# Altium schematic sheet 14 EC1 PHY.SchDoc
size 594 x 420 mm
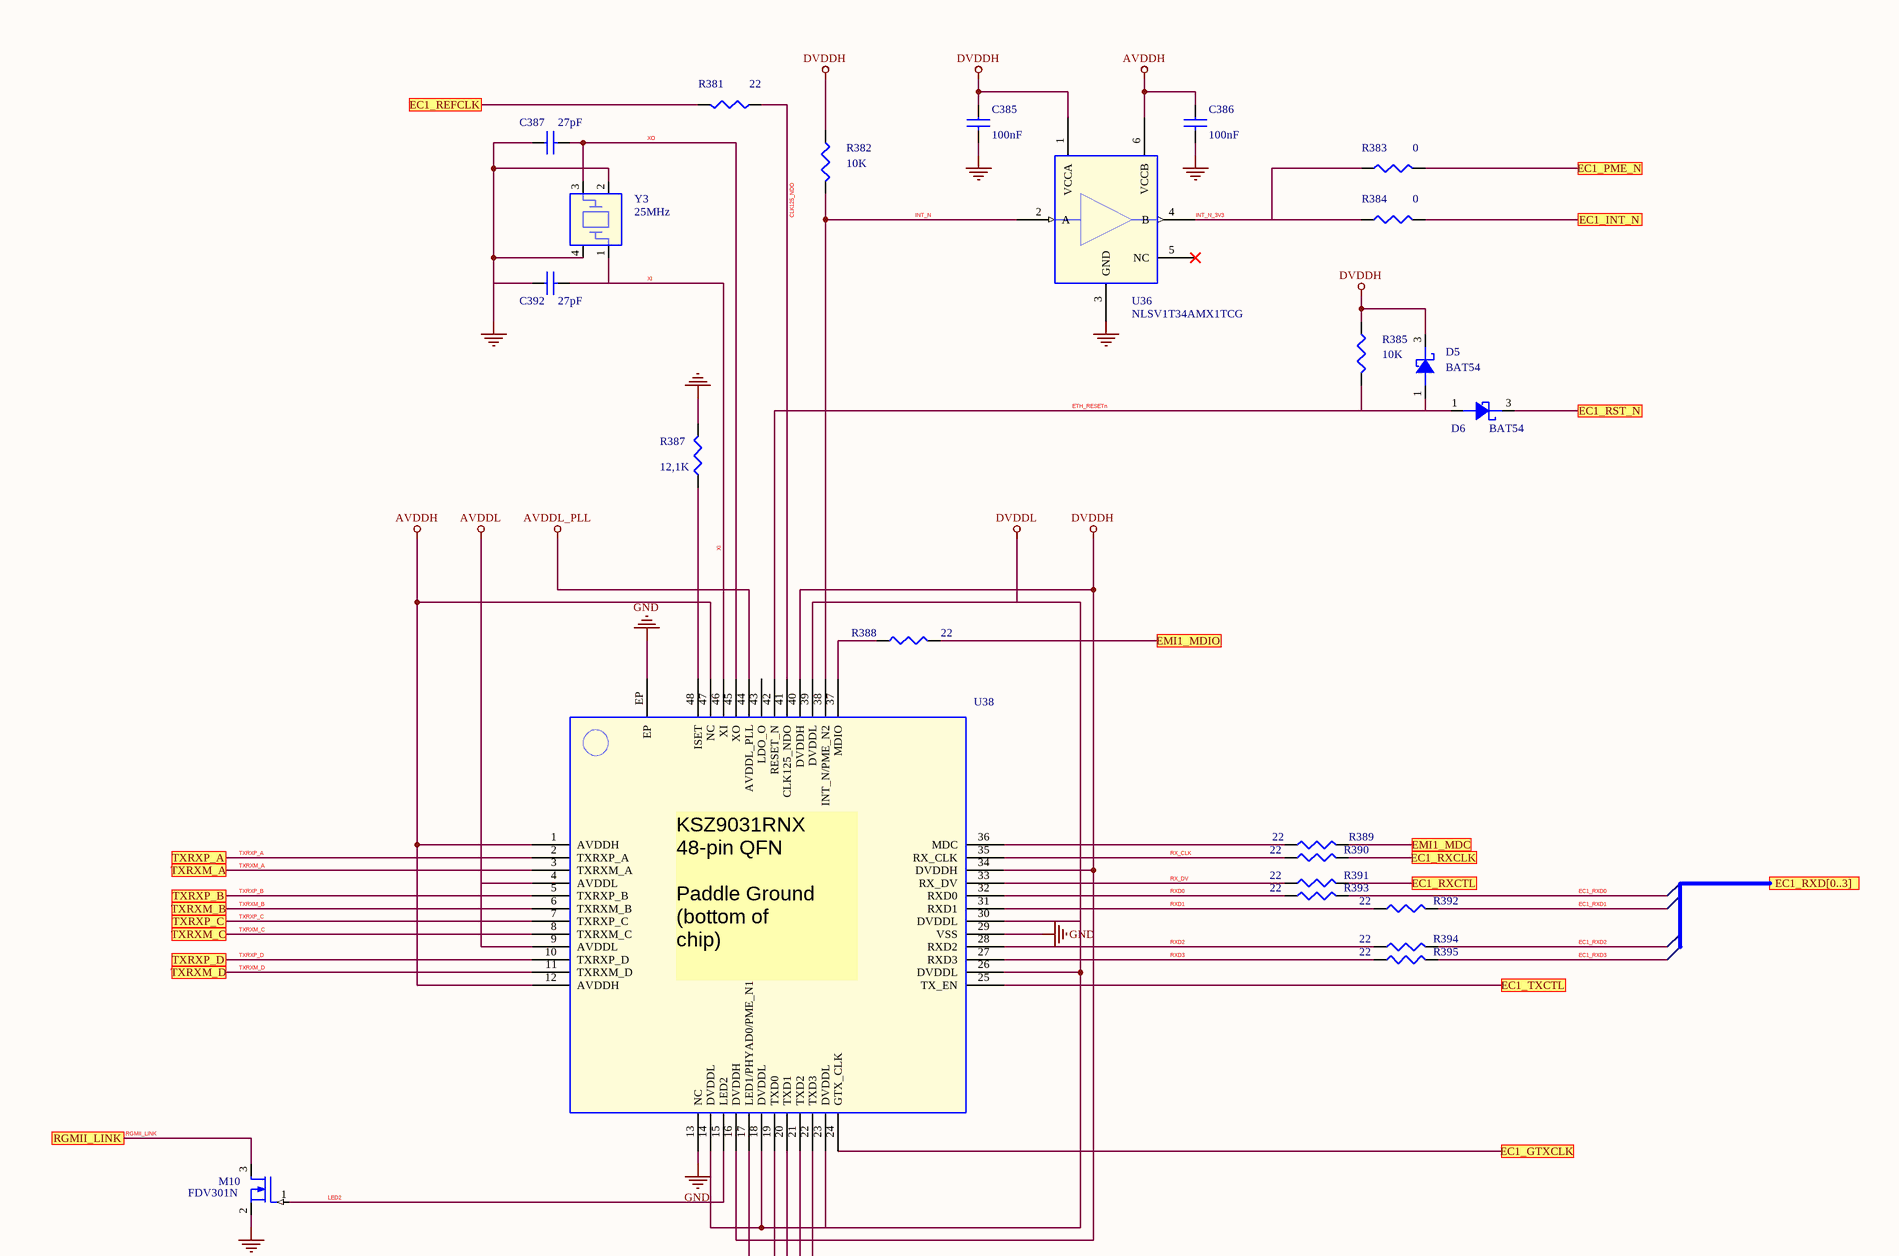
[diagram p0: 14 EC1 PHY.SchDoc, top left]
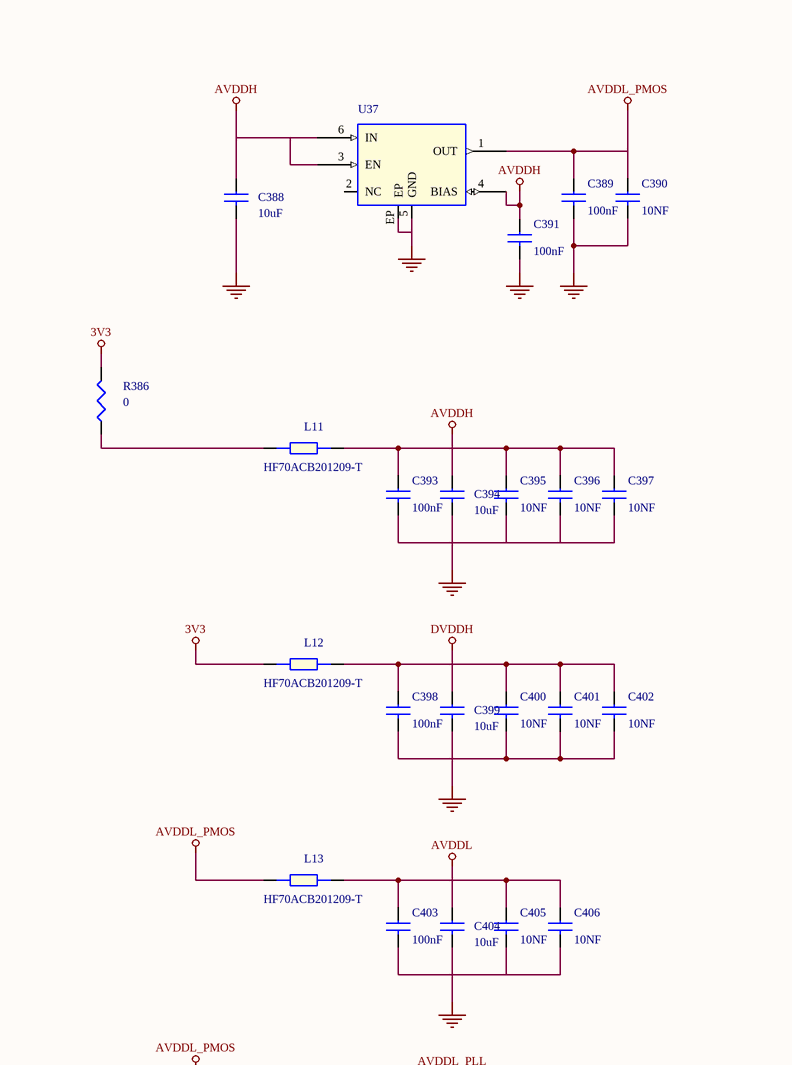
[diagram p1: 14 EC1 PHY.SchDoc, top right]
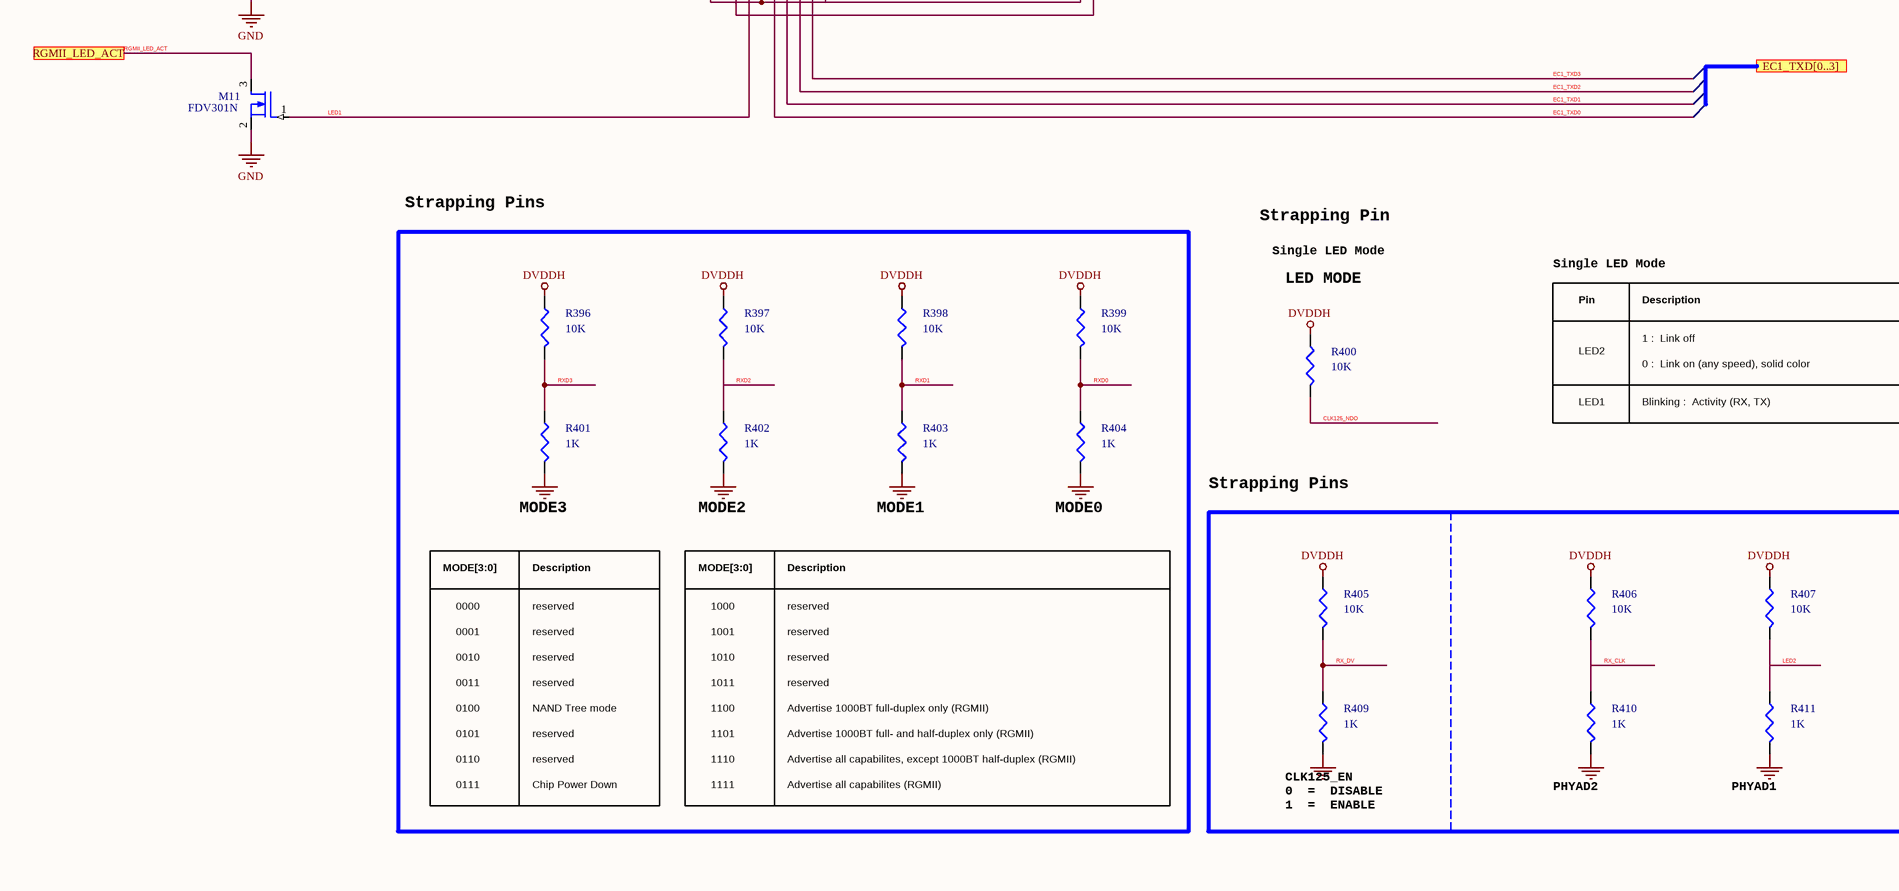
[diagram p2: 14 EC1 PHY.SchDoc, bottom left]
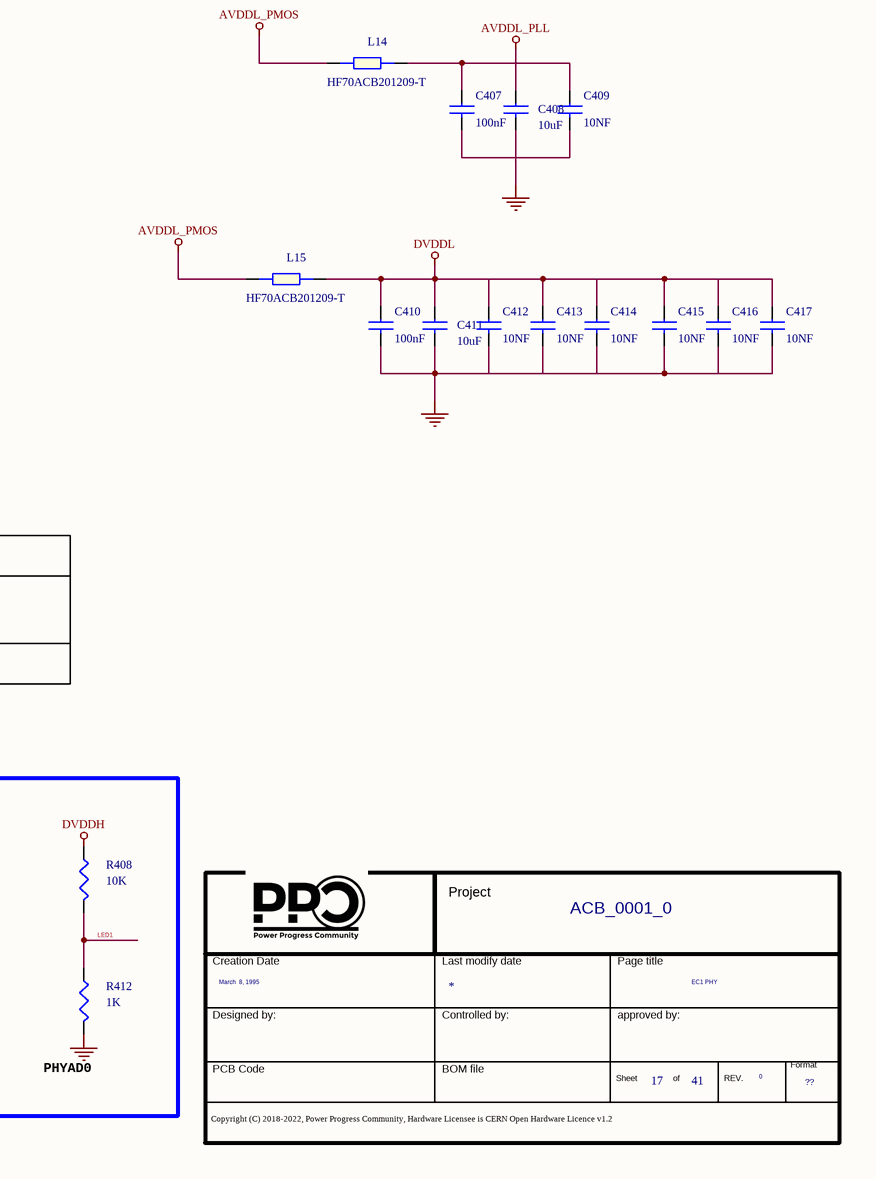
[diagram p3: 14 EC1 PHY.SchDoc, bottom right]

## Parts
*  Page Count: 41  Page Create Date: March  8, 1995  Page Number: 17  Page Size: ??  Page Title: EC1 PHY  RevCode: 0  Title: ACB_0001_0  (hidden comment: Title_block_PPC)  (graphical)
C385  100nF  [SMD_0402]
C386  100nF  [SMD_0402]
C387  27pF  [SMD_0402]
C388  10uF  [SMD_0603]
C389  100nF  [SMD_0402]
C390  10NF  [SMD_0402]
C391  100nF  [SMD_0402]
C392  27pF  [SMD_0402]
C393  100nF  [SMD_0402]
C394  10uF  [SMD_0603]
C395  10NF  [SMD_0402]
C396  10NF  [SMD_0402]
C397  10NF  [SMD_0402]
C398  100nF  [SMD_0402]
C399  10uF  [SMD_0603]
C400  10NF  [SMD_0402]
C401  10NF  [SMD_0402]
C402  10NF  [SMD_0402]
C403  100nF  [SMD_0402]
C404  10uF  [SMD_0603]
C405  10NF  [SMD_0402]
C406  10NF  [SMD_0402]
C407  100nF  [SMD_0402]
C408  10uF  [SMD_0603]
C409  10NF  [SMD_0402]
C410  100nF  [SMD_0402]
C411  10uF  [SMD_0603]
C412  10NF  [SMD_0402]
C413  10NF  [SMD_0402]
C414  10NF  [SMD_0402]
C415  10NF  [SMD_0402]
C416  10NF  [SMD_0402]
C417  10NF  [SMD_0402]
D5  BAT54  [SOT-23]
D6  BAT54  [SOT-23]
L11  HF70ACB201209-T  [SMD_0805]
L12  HF70ACB201209-T  [SMD_0805]
L13  HF70ACB201209-T  [SMD_0805]
L14  HF70ACB201209-T  [SMD_0805]
L15  HF70ACB201209-T  [SMD_0805]
M10  FDV301N  [sot23]
M11  FDV301N  [sot23]
R381  22  [SMD_0402]
R382  10K  [SMD_0402]
R383  0  [SMD_0402]
R384  0  [SMD_0402]
R385  10K  [SMD_0402]
R386  0  [SMD_0402]
R387  12,1K  [SMD_0402]
R388  22  [SMD_0402]
R389  22  [SMD_0402]
R390  22  [SMD_0402]
R391  22  [SMD_0402]
R392  22  [SMD_0402]
R393  22  [SMD_0402]
R394  22  [SMD_0402]
R395  22  [SMD_0402]
R396  10K  [SMD_0402]
R397  10K  [SMD_0402]
R398  10K  [SMD_0402]
R399  10K  [SMD_0402]
R400  10K  [SMD_0402]
R401  1K  [SMD_0402]
R402  1K  [SMD_0402]
R403  1K  [SMD_0402]
R404  1K  [SMD_0402]
R405  10K  [SMD_0402]
R406  10K  [SMD_0402]
R407  10K  [SMD_0402]
R408  10K  [SMD_0402]
R409  1K  [SMD_0402]
R410  1K  [SMD_0402]
R411  1K  [SMD_0402]
R412  1K  [SMD_0402]
U36  NLSV1T34AMX1TCG  [6-XFLGA]
U37  TPS72012DRVT  [6SON]  (value not drawn)
U38  KSZ9031RNXCA  [QFN48]  (value not drawn)
Y3  25MHz  [SMD_5.0x3.2]

## Ports
EC1_GTXCLK, EC1_INT_N, EC1_PME_N, EC1_REFCLK, EC1_RST_N, EC1_RXCLK, EC1_RXCTL, EC1_RXD[0..3], EC1_TXCTL, EC1_TXD[0..3], EMI1_MDC, EMI1_MDIO, RGMII_LED_ACT, RGMII_LINK, TXRXM_A, TXRXM_B, TXRXM_C, TXRXM_D, TXRXP_A, TXRXP_B, TXRXP_C, TXRXP_D

## Nets
3V3: L12.1 R386.1
AVDDH: C386.1 C388.1 C391.1 C393.1 C394.1 C395.1 C396.1 C397.1 L11.2 U36.6(VCCB) U37.3(EN) U37.4(BIAS) U37.6(IN) U38.1(AVDDH) U38.12(AVDDH) U38.47(NC)
AVDDL: C403.1 C404.1 C405.1 C406.1 L13.2 U38.4(AVDDL) U38.9(AVDDL)
AVDDL_PLL: C407.1 C408.1 C409.1 L14.2 U38.44(AVDDL_PLL)
AVDDL_PMOS: C389.1 C390.1 L13.1 L14.1 L15.1 U37.1(OUT)
DVDDH: C385.1 C398.1 C399.1 C400.1 C401.1 C402.1 D5.3(CATHODE) L12.2 R382.1 R385.1 R396.1 R397.1 R398.1 R399.1 R400.1 R405.1 R406.1 R407.1 R408.1 U36.1(VCCA) U38.16(DVDDH) U38.34(DVDDH) U38.40(DVDDH)
DVDDL: C410.1 C411.1 C412.1 C413.1 C414.1 C415.1 C416.1 C417.1 L15.2 U38.14(DVDDL) U38.18(DVDDL) U38.23(DVDDL) U38.26(DVDDL) U38.30(DVDDL) U38.39(DVDDL)
GND: C385.2 C386.2 C387.1 C388.2 C389.2 C390.2 C391.2 C392.1 C393.2 C394.2 C395.2 C396.2 C397.2 C398.2 C399.2 C400.2 C401.2 C402.2 C403.2 C404.2 C405.2 C406.2 C407.2 C408.2 C409.2 C410.2 C411.2 C412.2 C413.2 C414.2 C415.2 C416.2 C417.2 M10.2(SOURCE) M11.2(SOURCE) R387.1 R401.2 R402.2 R403.2 R404.2 R409.2 R410.2 R411.2 R412.2 U36.3(GND) U37.5(GND) U37.EP U38.13(NC) U38.29(VSS) U38.EP Y3.2 Y3.4
CLK125_NDO: R381.1 R400.2 U38.41(CLK125_NDO)
EC1_GTXCLK: U38.24(GTX_CLK) ; port EC1_GTXCLK
EC1_INT_N: R384.1 ; port EC1_INT_N
EC1_PME_N: R383.1 ; port EC1_PME_N
EC1_REFCLK: R381.2 ; port EC1_REFCLK
EC1_RST_N: D6.3(CATHODE) ; port EC1_RST_N
EC1_RXCLK: R390.1 ; port EC1_RXCLK
EC1_RXCTL: R391.1 ; port EC1_RXCTL
EC1_RXD0: R393.1
EC1_RXD1: R392.1
EC1_RXD2: R394.1
EC1_RXD3: R395.1
EC1_TXCTL: U38.25(TX_EN) ; port EC1_TXCTL
EC1_TXD0: U38.19(TXD0)
EC1_TXD1: U38.20(TXD1)
EC1_TXD2: U38.21(TXD2)
EC1_TXD3: U38.22(TXD3)
EMI1_MDC: R389.1 ; port EMI1_MDC
EMI1_MDIO: R388.1 ; port EMI1_MDIO
ETH_RESETn: D5.1(ANODE) D6.1(ANODE) R385.2 U38.42(RESET_N)
INT_N: R382.2 U36.2(A) U38.38(INT_N/PME_N2)
INT_N_3V3: R383.2 R384.2 U36.4(B)
LED1: M11.1(GATE) R408.2 R412.1 U38.17(LED1/PHYAD0/PME_N1)
LED2: M10.1(GATE) R407.2 R411.1 U38.15(LED2)
RGMII_LED_ACT: M11.3(DRAIN) ; port RGMII_LED_ACT
RGMII_LINK: M10.3(DRAIN) ; port RGMII_LINK
RX_CLK: R390.2 R406.2 R410.1 U38.35(RX_CLK)
RX_DV: R391.2 R405.2 R409.1 U38.33(RX_DV)
RXD0: R393.2 R399.2 R404.1 U38.32(RXD0)
RXD1: R392.2 R398.2 R403.1 U38.31(RXD1)
RXD2: R394.2 R397.2 R402.1 U38.28(RXD2)
RXD3: R395.2 R396.2 R401.1 U38.27(RXD3)
TXRXM_A: U38.3(TXRXM_A) ; port TXRXM_A
TXRXM_B: U38.6(TXRXM_B) ; port TXRXM_B
TXRXM_C: U38.8(TXRXM_C) ; port TXRXM_C
TXRXM_D: U38.11(TXRXM_D) ; port TXRXM_D
TXRXP_A: U38.2(TXRXP_A) ; port TXRXP_A
TXRXP_B: U38.5(TXRXP_B) ; port TXRXP_B
TXRXP_C: U38.7(TXRXP_C) ; port TXRXP_C
TXRXP_D: U38.10(TXRXP_D) ; port TXRXP_D
XI: C392.2 U38.46(XI) Y3.1
XO: C387.2 U38.45(XO) Y3.3
NetL11_1: L11.1 R386.2
NetR387_2: R387.2 U38.48(ISET)
NetR388_2: R388.2 U38.37(MDIO)
NetR389_2: R389.2 U38.36(MDC)

Not connected (* = marked no-connect by the designer): U36 5(NC)*; U37 2(NC); U38 43(LDO_O)

## Notes on the sheet
- Strapping Pins
- Strapping Pin
- Single LED Mode
- LED MODE
- Pin
- Description
- LED2
- 1 :  Link off
- 0 :  Link on (any speed), solid color
- LED1
- Blinking :  Activity (RX, TX)
- (near R401) MODE3
- (near R402) MODE2
- (near R403) MODE1
- (near R404) MODE0
- MODE[3:0]
- 0000
- 0001
- reserved
- 1001
- 1000
- 0010
- 0011
- 1010
- 1011
- 0100
- 0101
- 0110
- NAND Tree mode
- 1101
- 1100
- 1110
- Advertise all capabilites, except 1000BT half-duplex (RGMII)
- Advertise 1000BT full-duplex only (RGMII)
- Advertise 1000BT full- and half-duplex only (RGMII)
- (near R409) CLK125_EN
  0  =  DISABLE
  1  =  ENABLE
- 0111
- Chip Power Down
- 1111
- Advertise all capabilites (RGMII)
- (near R410) PHYAD2
- (near R411) PHYAD1
- (near R412) PHYAD0
- (in symbol KSZ9031RNX_0) KSZ9031RNX / 48-pin QFN / Paddle Ground / (bottom of / chip)
- (in symbol Title_block_PPC) Project; Creation Date; Last modify date; Page title; Designed by:; Controlled by:; approved by:; Format; PCB Code; BOM file; Sheet; of; REV.; Copyright (C) 2018-2022, Power Progress Community, Hardware Licensee is CERN Open Hardware Licence v1.2

## Library data of the parts
C385 = CAP NP_Dup10: COND.CER. 100NF 50V 0402 X7R SMD; Part Number: PASSIVE_24; Manufacturer 1: TDK; Manufacturer Part Number 1: CGA2B3X7R1H104M050BD; RSM: RC0402; TECNO77: C0402; ID: C496; PCB Footprint: SMD_0402; Part Type: Capacitors\Ceramic\SMD\0402; Distributor 1: MURATA ELETTRONICA SPA
C386 = CAP NP_Dup10: COND.CER. 100NF 50V 0402 X7R SMD; Part Number: PASSIVE_24; Manufacturer 1: TDK; Manufacturer Part Number 1: CGA2B3X7R1H104M050BD; RSM: RC0402; TECNO77: C0402; ID: C497; PCB Footprint: SMD_0402; Part Type: Capacitors\Ceramic\SMD\0402; Distributor 1: MURATA ELETTRONICA SPA
C387 = CAP NP_Dup10: CAP CER 27PF 50V 5% NP0 0402; Part Number: PASSIVE_68; Manufacturer 1: TDK; Manufacturer Part Number 1: C1005C0G1H270J; RSM: RC0402; TECNO77: C0402; ID: C319; PCB Footprint: SMD_0402; Part Type: Capacitors\Ceramic\SMD\0402; Distributor 1: DIGIKEY (445-1240-1-ND)
C388 = CAP NP_Dup10: COND.CER.10uF 0603 25V SMD; Manufacturer Part Number 1: CL10A106MA8NRNC; Manufacturer 1: SAMSUNG; Part Number: PASSIVE_124; RSM: RC0603; TECNO77: C0402; ID: C325; PCB Footprint: SMD_0603; Distributor 1: DIGIKEY (1276-1450-2-ND); Part Type: Capacitors\Ceramic\SMD\0603
C389 = CAP NP_Dup10: COND.CER. 100NF 50V 0402 X7R SMD; Manufacturer Part Number 1: CGA2B3X7R1H104M050BD; Manufacturer 1: TDK; Part Number: PASSIVE_24; RSM: RC0402; TECNO77: C0402; ID: C322; PCB Footprint: SMD_0402; Distributor 1: MURATA ELETTRONICA SPA; Part Type: Capacitors\Ceramic\SMD\0402
C390 = CAP NP_Dup10: COND.CER. 10NF 50V 0402 X7R SMD; Part Number: PASSIVE_29; Manufacturer 1: KEMET; Manufacturer Part Number 1: C0402C103K5RACTU; RSM: RC0402; TECNO77: C0402; ID: C323; PCB Footprint: SMD_0402; Part Type: Capacitors\Ceramic\SMD\0402; Distributor 1: TTI ITALY SRL
C391 = CAP NP_Dup10: COND.CER. 100NF 50V 0402 X7R SMD; Part Number: PASSIVE_24; Manufacturer 1: TDK; Manufacturer Part Number 1: CGA2B3X7R1H104M050BD; RSM: RC0402; TECNO77: C0402; ID: C787; PCB Footprint: SMD_0402; Part Type: Capacitors\Ceramic\SMD\0402; Distributor 1: MURATA ELETTRONICA SPA
C392 = CAP NP_Dup10: CAP CER 27PF 50V 5% NP0 0402; Manufacturer Part Number 1: C1005C0G1H270J; Manufacturer 1: TDK; Part Number: PASSIVE_68; RSM: RC0402; TECNO77: C0402; ID: C320; PCB Footprint: SMD_0402; Distributor 1: DIGIKEY (445-1240-1-ND); Part Type: Capacitors\Ceramic\SMD\0402
C393 = CAP NP_Dup10: COND.CER. 100NF 50V 0402 X7R SMD; Part Number: PASSIVE_24; Manufacturer 1: TDK; Manufacturer Part Number 1: CGA2B3X7R1H104M050BD; RSM: RC0402; TECNO77: C0402; ID: C329; PCB Footprint: SMD_0402; Part Type: Capacitors\Ceramic\SMD\0402; Distributor 1: MURATA ELETTRONICA SPA
C394 = CAP NP_Dup3: COND.CER.10uF 0603 25V SMD; Manufacturer Part Number 1: CL10A106MA8NRNC; Manufacturer 1: SAMSUNG; Part Number: PASSIVE_124; RSM: RC0603; PCB Footprint: SMD_0603; Part Type: Capacitors\Ceramic\SMD\0603
C395 = CAP NP_Dup10: COND.CER. 10NF 50V 0402 X7R SMD; Part Number: PASSIVE_29; Manufacturer 1: KEMET; Manufacturer Part Number 1: C0402C103K5RACTU; RSM: RC0402; TECNO77: C0402; ID: C331; PCB Footprint: SMD_0402; Part Type: Capacitors\Ceramic\SMD\0402; Distributor 1: TTI ITALY SRL
C396 = CAP NP_Dup10: COND.CER. 10NF 50V 0402 X7R SMD; Part Number: PASSIVE_29; Manufacturer 1: KEMET; Manufacturer Part Number 1: C0402C103K5RACTU; RSM: RC0402; TECNO77: C0402; ID: C332; PCB Footprint: SMD_0402; Part Type: Capacitors\Ceramic\SMD\0402; Distributor 1: TTI ITALY SRL
C397 = CAP NP_Dup10: COND.CER. 10NF 50V 0402 X7R SMD; Part Number: PASSIVE_29; Manufacturer 1: KEMET; Manufacturer Part Number 1: C0402C103K5RACTU; RSM: RC0402; TECNO77: C0402; ID: C333; PCB Footprint: SMD_0402; Part Type: Capacitors\Ceramic\SMD\0402; Distributor 1: TTI ITALY SRL
C398 = CAP NP_Dup10: COND.CER. 100NF 50V 0402 X7R SMD; Manufacturer Part Number 1: CGA2B3X7R1H104M050BD; Manufacturer 1: TDK; Part Number: PASSIVE_24; RSM: RC0402; TECNO77: C0402; ID: C335; PCB Footprint: SMD_0402; Distributor 1: MURATA ELETTRONICA SPA; Part Type: Capacitors\Ceramic\SMD\0402
C399 = CAP NP_Dup10: COND.CER.10uF 0603 25V SMD; Part Number: PASSIVE_124; Manufacturer 1: SAMSUNG; Manufacturer Part Number 1: CL10A106MA8NRNC; RSM: RC0603; TECNO77: C0402; ID: C336; PCB Footprint: SMD_0603; Part Type: Capacitors\Ceramic\SMD\0603; Distributor 1: DIGIKEY (1276-1450-2-ND)
C400 = CAP NP_Dup10: COND.CER. 10NF 50V 0402 X7R SMD; Manufacturer Part Number 1: C0402C103K5RACTU; Manufacturer 1: KEMET; Part Number: PASSIVE_29; RSM: RC0402; TECNO77: C0402; ID: C337; PCB Footprint: SMD_0402; Distributor 1: TTI ITALY SRL; Part Type: Capacitors\Ceramic\SMD\0402
C401 = CAP NP_Dup10: COND.CER. 10NF 50V 0402 X7R SMD; Part Number: PASSIVE_29; Manufacturer 1: KEMET; Manufacturer Part Number 1: C0402C103K5RACTU; RSM: RC0402; TECNO77: C0402; ID: C338; PCB Footprint: SMD_0402; Part Type: Capacitors\Ceramic\SMD\0402; Distributor 1: TTI ITALY SRL
C402 = CAP NP_Dup10: COND.CER. 10NF 50V 0402 X7R SMD; Part Number: PASSIVE_29; Manufacturer 1: KEMET; Manufacturer Part Number 1: C0402C103K5RACTU; RSM: RC0402; TECNO77: C0402; ID: C339; PCB Footprint: SMD_0402; Part Type: Capacitors\Ceramic\SMD\0402; Distributor 1: TTI ITALY SRL
C403 = CAP NP_Dup10: COND.CER. 100NF 50V 0402 X7R SMD; Manufacturer Part Number 1: CGA2B3X7R1H104M050BD; Manufacturer 1: TDK; Part Number: PASSIVE_24; RSM: RC0402; TECNO77: C0402; ID: C340; PCB Footprint: SMD_0402; Distributor 1: MURATA ELETTRONICA SPA; Part Type: Capacitors\Ceramic\SMD\0402
C404 = CAP NP_Dup10: COND.CER.10uF 0603 25V SMD; Part Number: PASSIVE_124; Manufacturer 1: SAMSUNG; Manufacturer Part Number 1: CL10A106MA8NRNC; RSM: RC0603; TECNO77: C0402; ID: C341; PCB Footprint: SMD_0603; Part Type: Capacitors\Ceramic\SMD\0603; Distributor 1: DIGIKEY (1276-1450-2-ND)
C405 = CAP NP_Dup10: COND.CER. 10NF 50V 0402 X7R SMD; Part Number: PASSIVE_29; Manufacturer 1: KEMET; Manufacturer Part Number 1: C0402C103K5RACTU; RSM: RC0402; TECNO77: C0402; ID: C342; PCB Footprint: SMD_0402; Part Type: Capacitors\Ceramic\SMD\0402; Distributor 1: TTI ITALY SRL
C406 = CAP NP_Dup10: COND.CER. 10NF 50V 0402 X7R SMD; Manufacturer Part Number 1: C0402C103K5RACTU; Manufacturer 1: KEMET; Part Number: PASSIVE_29; RSM: RC0402; TECNO77: C0402; ID: C343; PCB Footprint: SMD_0402; Distributor 1: TTI ITALY SRL; Part Type: Capacitors\Ceramic\SMD\0402
C407 = CAP NP_Dup10: COND.CER. 100NF 50V 0402 X7R SMD; Manufacturer Part Number 1: CGA2B3X7R1H104M050BD; Manufacturer 1: TDK; Part Number: PASSIVE_24; RSM: RC0402; TECNO77: C0402; ID: C344; PCB Footprint: SMD_0402; Distributor 1: MURATA ELETTRONICA SPA; Part Type: Capacitors\Ceramic\SMD\0402
C408 = CAP NP_Dup10: COND.CER.10uF 0603 25V SMD; Part Number: PASSIVE_124; Manufacturer 1: SAMSUNG; Manufacturer Part Number 1: CL10A106MA8NRNC; RSM: RC0603; TECNO77: C0402; ID: C345; PCB Footprint: SMD_0603; Part Type: Capacitors\Ceramic\SMD\0603; Distributor 1: DIGIKEY (1276-1450-2-ND)
C409 = CAP NP_Dup10: COND.CER. 10NF 50V 0402 X7R SMD; Part Number: PASSIVE_29; Manufacturer 1: KEMET; Manufacturer Part Number 1: C0402C103K5RACTU; RSM: RC0402; TECNO77: C0402; ID: C346; PCB Footprint: SMD_0402; Part Type: Capacitors\Ceramic\SMD\0402; Distributor 1: TTI ITALY SRL
C410 = CAP NP_Dup10: COND.CER. 100NF 50V 0402 X7R SMD; Manufacturer Part Number 1: CGA2B3X7R1H104M050BD; Manufacturer 1: TDK; Part Number: PASSIVE_24; RSM: RC0402; TECNO77: C0402; ID: C347; PCB Footprint: SMD_0402; Distributor 1: MURATA ELETTRONICA SPA; Part Type: Capacitors\Ceramic\SMD\0402
C411 = CAP NP_Dup10: COND.CER.10uF 0603 25V SMD; Part Number: PASSIVE_124; Manufacturer 1: SAMSUNG; Manufacturer Part Number 1: CL10A106MA8NRNC; RSM: RC0603; TECNO77: C0402; ID: C348; PCB Footprint: SMD_0603; Part Type: Capacitors\Ceramic\SMD\0603; Distributor 1: DIGIKEY (1276-1450-2-ND)
C412 = CAP NP_Dup10: COND.CER. 10NF 50V 0402 X7R SMD; Part Number: PASSIVE_29; Manufacturer 1: KEMET; Manufacturer Part Number 1: C0402C103K5RACTU; RSM: RC0402; TECNO77: C0402; ID: C349; PCB Footprint: SMD_0402; Part Type: Capacitors\Ceramic\SMD\0402; Distributor 1: TTI ITALY SRL
C413 = CAP NP_Dup10: COND.CER. 10NF 50V 0402 X7R SMD; Manufacturer Part Number 1: C0402C103K5RACTU; Manufacturer 1: KEMET; Part Number: PASSIVE_29; RSM: RC0402; TECNO77: C0402; ID: C350; PCB Footprint: SMD_0402; Distributor 1: TTI ITALY SRL; Part Type: Capacitors\Ceramic\SMD\0402
C414 = CAP NP_Dup10: COND.CER. 10NF 50V 0402 X7R SMD; Part Number: PASSIVE_29; Manufacturer 1: KEMET; Manufacturer Part Number 1: C0402C103K5RACTU; RSM: RC0402; TECNO77: C0402; ID: C351; PCB Footprint: SMD_0402; Part Type: Capacitors\Ceramic\SMD\0402; Distributor 1: TTI ITALY SRL
C415 = CAP NP_Dup10: COND.CER. 10NF 50V 0402 X7R SMD; Part Number: PASSIVE_29; Manufacturer 1: KEMET; Manufacturer Part Number 1: C0402C103K5RACTU; RSM: RC0402; TECNO77: C0402; ID: C352; PCB Footprint: SMD_0402; Part Type: Capacitors\Ceramic\SMD\0402; Distributor 1: TTI ITALY SRL
C416 = CAP NP_Dup10: COND.CER. 10NF 50V 0402 X7R SMD; Part Number: PASSIVE_29; Manufacturer 1: KEMET; Manufacturer Part Number 1: C0402C103K5RACTU; RSM: RC0402; TECNO77: C0402; ID: C353; PCB Footprint: SMD_0402; Part Type: Capacitors\Ceramic\SMD\0402; Distributor 1: TTI ITALY SRL
C417 = CAP NP_Dup10: COND.CER. 10NF 50V 0402 X7R SMD; Manufacturer Part Number 1: C0402C103K5RACTU; Manufacturer 1: KEMET; Part Number: PASSIVE_29; RSM: RC0402; TECNO77: C0402; ID: C354; PCB Footprint: SMD_0402; Distributor 1: TTI ITALY SRL; Part Type: Capacitors\Ceramic\SMD\0402
D5 = diode_schottky_SOT23_Dup1: DIODE SCHOTTKY 30V 200MA SOT-23; Manufacturer 1: ZETEX; Part Number: DISCRETE_84; ID: D19; TECNO77: SOT23_P321; PCB Footprint: SOT-23; Distributor 1: FARNELL (1467516); Manufacturer Part Number 1: BAT54; Part Type: Diodes\SCHOTTKY; RSM: SOT-23
D6 = diode_schottky_SOT23_Dup1: DIODE SCHOTTKY 30V 200MA SOT-23; Manufacturer 1: ZETEX; Part Number: DISCRETE_84; ID: D20; TECNO77: SOT23_P321; PCB Footprint: SOT-23; Distributor 1: FARNELL (1467516); Manufacturer Part Number 1: BAT54; Part Type: Diodes\SCHOTTKY; RSM: SOT-23
L11 = FERRITE_BEAD_Dup2: FERRITE CHIP 10 OHM 600MA 0805; Part Number: PASSIVE_397; Manufacturer 1: TDK; RSM: RC0805; ID: L24; TECNO77: L0805; PCB Footprint: SMD_0805; Part Type: Ferrite Beads\SMD\0805; Manufacturer Part Number 1: HF70ACB201209-T; Distributor 1: DIGIKEY (445-6180-1-ND)
L12 = FERRITE_BEAD_Dup2: FERRITE CHIP 10 OHM 600MA 0805; Part Number: PASSIVE_397; Manufacturer 1: TDK; RSM: RC0805; ID: L25; TECNO77: L0805; PCB Footprint: SMD_0805; Part Type: Ferrite Beads\SMD\0805; Manufacturer Part Number 1: HF70ACB201209-T; Distributor 1: DIGIKEY (445-6180-1-ND)
L13 = FERRITE_BEAD_Dup2: FERRITE CHIP 10 OHM 600MA 0805; Part Number: PASSIVE_397; Manufacturer 1: TDK; RSM: RC0805; ID: L27; TECNO77: L0805; PCB Footprint: SMD_0805; Part Type: Ferrite Beads\SMD\0805; Manufacturer Part Number 1: HF70ACB201209-T; Distributor 1: DIGIKEY (445-6180-1-ND)
L14 = FERRITE_BEAD_Dup2: FERRITE CHIP 10 OHM 600MA 0805; Part Number: PASSIVE_397; Manufacturer 1: TDK; RSM: RC0805; ID: L29; TECNO77: L0805; PCB Footprint: SMD_0805; Part Type: Ferrite Beads\SMD\0805; Manufacturer Part Number 1: HF70ACB201209-T; Distributor 1: DIGIKEY (445-6180-1-ND)
L15 = FERRITE_BEAD_Dup2: FERRITE CHIP 10 OHM 600MA 0805; Part Number: PASSIVE_397; Manufacturer 1: TDK; RSM: RC0805; ID: L31; TECNO77: L0805; PCB Footprint: SMD_0805; Part Type: Ferrite Beads\SMD\0805; Manufacturer Part Number 1: HF70ACB201209-T; Distributor 1: DIGIKEY (445-6180-1-ND)
M10 = NMOS_SOT23_Dup1: FDV301N N CHANNEL DIGITAL FET; Part Number: DISCRETE_196; Manufacturer 1: FAIRCHILD; Manufacturer Part Number 1: FDV301N  (ROHS COMPLIANT); ID: M23; TECNO77: SOT23_P321; RSM: SOT-23; PCB Footprint: sot23; Part Type: Mosfet\SOT23; Distributor 1: CLAITRON LASI SILVESTAR S.R.L
M11 = NMOS_SOT23_Dup1: FDV301N N CHANNEL DIGITAL FET; Manufacturer Part Number 1: FDV301N  (ROHS COMPLIANT); Manufacturer 1: FAIRCHILD; Part Number: DISCRETE_196; ID: M24; TECNO77: SOT23_P321; RSM: SOT-23; PCB Footprint: sot23; Distributor 1: CLAITRON LASI SILVESTAR S.R.L; Part Type: Mosfet\SOT23
R381 = R_Dup9: RESIS.CHIP 22R 5% 0402 SMD; Part Number: PASSIVE_840; Manufacturer 1: ROYAL OHM; TECNO77: R0402; ID: R293; RSM: RC0402; PCB Footprint: SMD_0402; Part Type: Resistors\Fixed\SMD\0402\5%; Manufacturer Part Number 1: RESIS.CHIP 22R 5% 0402 SMD; Distributor 1: CAMEL ELETTRONICA SRL  #
R382 R385 R396-R400 R405-R408 = R_Dup6: RESIS.CHIP 10K 1% 0402 SMD; Manufacturer 1: ROYAL OHM; Part Number: PASSIVE_584; RSM: RC0402; Manufacturer Part Number 1: RESIS.CHIP 10K 1% 0402 SMD; PCB Footprint: SMD_0402; Part Type: Resistors\Fixed\SMD\0402\1%
R383 = R_Dup9: RESIS.CHIP 0R 5% 0402 SMD; Part Number: PASSIVE_805; Manufacturer 1: ROYAL OHM; RSM: RC0402; TECNO77: R0402; ID: R298; PCB Footprint: SMD_0402; Part Type: Resistors\Fixed\SMD\0402\5%; Manufacturer Part Number 1: RESIS.CHIP 0R 5% 0402 SMD; Distributor 1: CAMEL ELETTRONICA SRL  #
R384 = R_Dup9: RESIS.CHIP 0R 5% 0402 SMD; Part Number: PASSIVE_805; Manufacturer 1: ROYAL OHM; RSM: RC0402; TECNO77: R0402; ID: R296; PCB Footprint: SMD_0402; Part Type: Resistors\Fixed\SMD\0402\5%; Manufacturer Part Number 1: RESIS.CHIP 0R 5% 0402 SMD; Distributor 1: CAMEL ELETTRONICA SRL  #
R386 = R_Dup9: RESIS.CHIP 0R 5% 0402 SMD; Part Number: PASSIVE_805; Manufacturer 1: ROYAL OHM; RSM: RC0402; ID: R301; TECNO77: R0402; PCB Footprint: SMD_0402; Part Type: Resistors\Fixed\SMD\0402\5%; Manufacturer Part Number 1: RESIS.CHIP 0R 5% 0402 SMD; Distributor 1: CAMEL ELETTRONICA SRL  #
R387 = R_Dup9: RESIS.CHIP 12,1K 1% 0402 SMD; Part Number: PASSIVE_590; Manufacturer 1: ROYAL OHM; TECNO77: R0402; ID: R299; RSM: RC0402; PCB Footprint: SMD_0402; Part Type: Resistors\Fixed\SMD\0402\1%; Manufacturer Part Number 1: RESIS.CHIP 12,1K 1% 0402 SMD; Distributor 1: CAMEL ELETTRONICA SRL  #
R388 = R_Dup9: RESIS.CHIP 22R 5% 0402 SMD; Part Number: PASSIVE_840; Manufacturer 1: ROYAL OHM; TECNO77: R0402; ID: R304; RSM: RC0402; PCB Footprint: SMD_0402; Part Type: Resistors\Fixed\SMD\0402\5%; Manufacturer Part Number 1: RESIS.CHIP 22R 5% 0402 SMD; Distributor 1: CAMEL ELETTRONICA SRL  #
R389 = R_Dup9: RESIS.CHIP 22R 5% 0402 SMD; Manufacturer 1: ROYAL OHM; Part Number: PASSIVE_840; ID: R305; TECNO77: R0402; RSM: RC0402; PCB Footprint: SMD_0402; Distributor 1: CAMEL ELETTRONICA SRL  #; Manufacturer Part Number 1: RESIS.CHIP 22R 5% 0402 SMD; Part Type: Resistors\Fixed\SMD\0402\5%
R390 = R_Dup9: RESIS.CHIP 22R 5% 0402 SMD; Manufacturer 1: ROYAL OHM; Part Number: PASSIVE_840; ID: R306; TECNO77: R0402; RSM: RC0402; PCB Footprint: SMD_0402; Distributor 1: CAMEL ELETTRONICA SRL  #; Manufacturer Part Number 1: RESIS.CHIP 22R 5% 0402 SMD; Part Type: Resistors\Fixed\SMD\0402\5%
R391 = R_Dup9: RESIS.CHIP 22R 5% 0402 SMD; Part Number: PASSIVE_840; Manufacturer 1: ROYAL OHM; ID: R307; TECNO77: R0402; RSM: RC0402; PCB Footprint: SMD_0402; Part Type: Resistors\Fixed\SMD\0402\5%; Manufacturer Part Number 1: RESIS.CHIP 22R 5% 0402 SMD; Distributor 1: CAMEL ELETTRONICA SRL  #
R392 = R_Dup9: RESIS.CHIP 22R 5% 0402 SMD; Part Number: PASSIVE_840; Manufacturer 1: ROYAL OHM; TECNO77: R0402; ID: R309; RSM: RC0402; PCB Footprint: SMD_0402; Part Type: Resistors\Fixed\SMD\0402\5%; Manufacturer Part Number 1: RESIS.CHIP 22R 5% 0402 SMD; Distributor 1: CAMEL ELETTRONICA SRL  #
R393 = R_Dup9: RESIS.CHIP 22R 5% 0402 SMD; Part Number: PASSIVE_840; Manufacturer 1: ROYAL OHM; ID: R308; TECNO77: R0402; RSM: RC0402; PCB Footprint: SMD_0402; Part Type: Resistors\Fixed\SMD\0402\5%; Manufacturer Part Number 1: RESIS.CHIP 22R 5% 0402 SMD; Distributor 1: CAMEL ELETTRONICA SRL  #
R394 = R_Dup9: RESIS.CHIP 22R 5% 0402 SMD; Part Number: PASSIVE_840; Manufacturer 1: ROYAL OHM; TECNO77: R0402; ID: R310; RSM: RC0402; PCB Footprint: SMD_0402; Part Type: Resistors\Fixed\SMD\0402\5%; Manufacturer Part Number 1: RESIS.CHIP 22R 5% 0402 SMD; Distributor 1: CAMEL ELETTRONICA SRL  #
R395 = R_Dup9: RESIS.CHIP 22R 5% 0402 SMD; Part Number: PASSIVE_840; Manufacturer 1: ROYAL OHM; TECNO77: R0402; ID: R311; RSM: RC0402; PCB Footprint: SMD_0402; Part Type: Resistors\Fixed\SMD\0402\5%; Manufacturer Part Number 1: RESIS.CHIP 22R 5% 0402 SMD; Distributor 1: CAMEL ELETTRONICA SRL  #
R401-R404 R409-R412 = R_Dup6: RESIS.CHIP 1K 1% 0402 SMD; Manufacturer 1: ROYAL OHM; Part Number: PASSIVE_628; RSM: RC0402; Manufacturer Part Number 1: RESIS.CHIP 1K 1% 0402 SMD; PCB Footprint: SMD_0402; Part Type: Resistors\Fixed\SMD\0402\1%
U36 = NLSV1T34: IC XLATOR 1BIT NON-INV 6ULLGA; Manufacturer 1: ON Semi; Part Number: LOGIC_253; RSM: ULLGA-6-1_45X1; ID: U59; TECNO77: LLGA6-1.45X1; CLASS: IC; Distributor 1: DIGIKEY (NLSV1T34AMX1TCGOSTR-ND); Manufacturer Part Number 1: NLSV1T34AMX1TCG; Part Type: TRANSLATOR; PCB Footprint: 6-XFLGA
U37 = TPS720XX_1: IC REG LDO 1.2V 0.35A 6SON; Manufacturer 1: TEXAS; Part Number: LINEAR_129; RSM: WSON-6-2_1X2_1; Instance: ?; PCB Footprint: 6SON; Distributor 1: DIGIKEY (296-25807-2-ND); Manufacturer Part Number 1: TPS72012DRVT; Part Type: Regulators\LDO
U38 = KSZ9031RNX_0: Gigabit Ethernet Transceiver with RGMII, WOL; Manufacturer 1: Micrel; Part Number: LOGIC_86; RSM: QFN-48-EP; Distributor 1: MOUSER(998-KSZ9031RNXCA); Manufacturer Part Number 1: KSZ9031RNXCA; Part Type: ETHERNET\GIGABIT; PCB Footprint: QFN48
Y3 = CRYSTAL_4P_Dup3: CRYSTAL 25.000 MHZ 20PF SMD; Part Number: MISC_166; Manufacturer 1: ECS; Manufacturer Part Number 1: ECS-250-20-30B-TR (ROHS COMPLIANT); RSM: XC-CSX2; TECNO77: OSC4P3.8(5X3.2)-SMT; ID: Y3; Part Type: Quartz; Distributor 1: DIGIKEY (XC1124CT-ND); PCB Footprint: SMD_5.0x3.2
* = Title_block_PPC: Page Modify Date: *